# Altium schematic sheet Sheet1.SchDoc
size A3
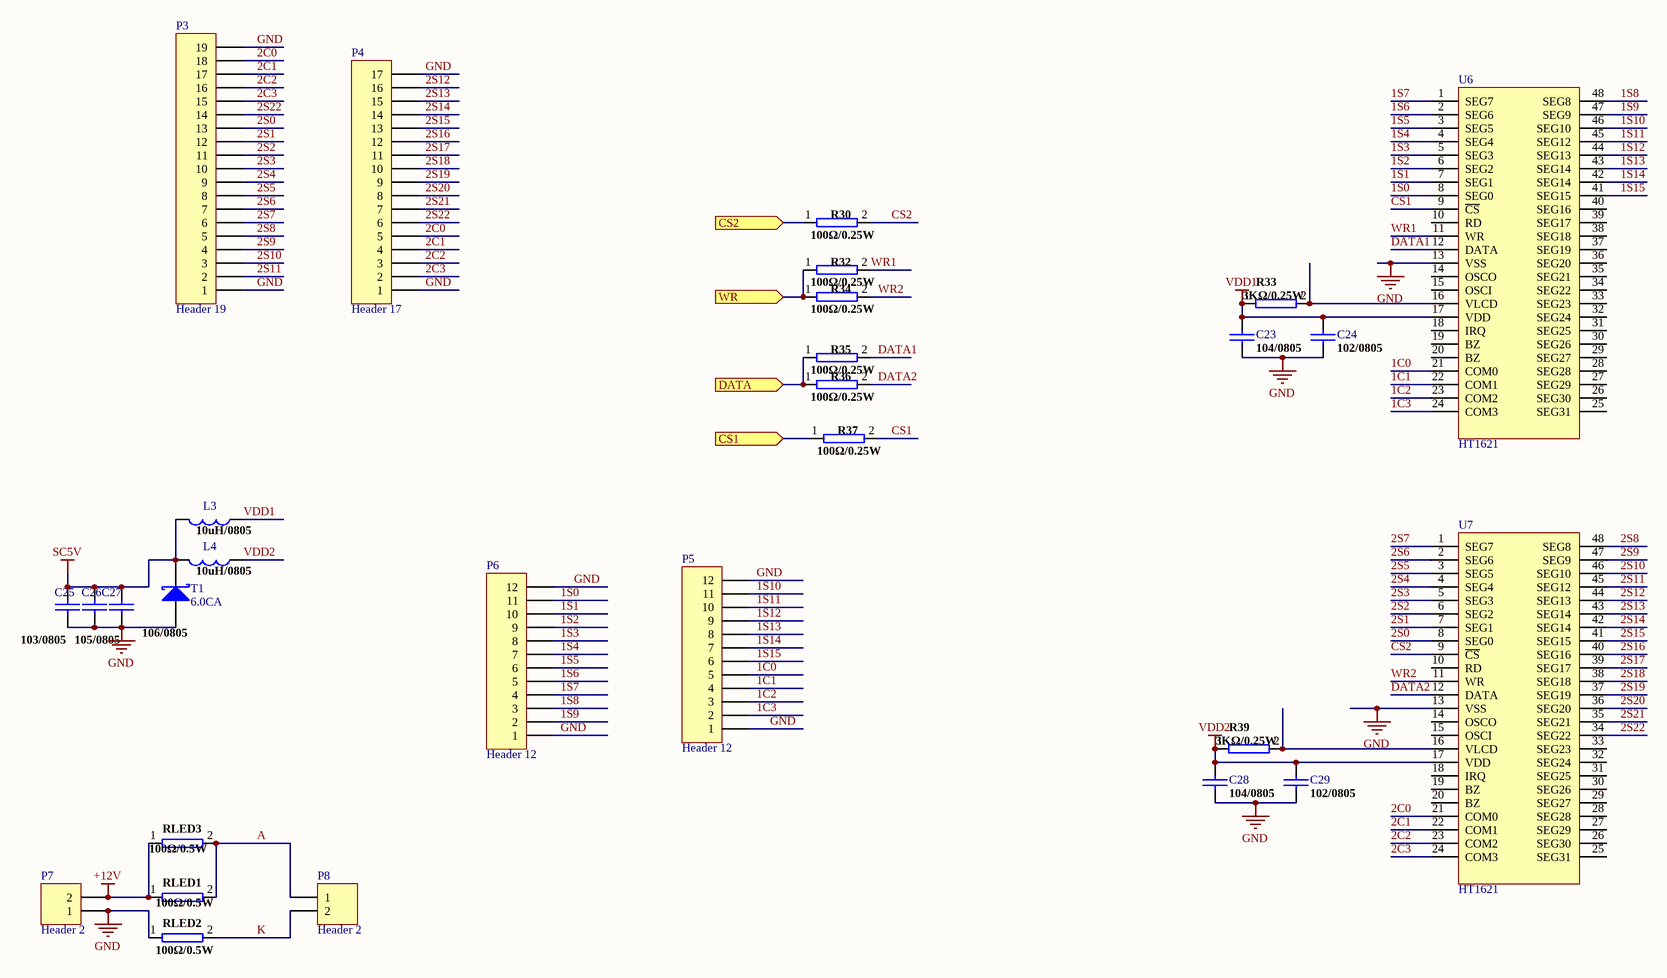
[diagram p0: Sheet1.SchDoc]

## Parts
C23  104/0805  [C0805]
C24  102/0805  [C0805]
C25  103/0805  [C0805]
C26  105/0805  [C0805]
C27  106/0805  [C0805]
C28  104/0805  [C0805]
C29  102/0805  [C0805]
L3  10uH/0805  [L0805]
L4  10uH/0805  [L0805]
P3  Header 19  [H1*19]
P4  Header 17  [H1*17]
P5  Header 12  [H1*12]
P6  Header 12  [H1*12]
P7  Header 2  [CN2]
P8  Header 2  [CN2]
R30  100Ω/0.25W  [R0805]
R32  100Ω/0.25W  [R0805]
R33  3KΩ/0.25W  [R0805]
R34  100Ω/0.25W  [R0805]
R35  100Ω/0.25W  [R0805]
R36  100Ω/0.25W  [R0805]
R37  100Ω/0.25W  [R0805]
R39  3KΩ/0.25W  [R0805]
RLED1  100Ω/0.5W  [1206]
RLED2  100Ω/0.5W  [1206]
RLED3  100Ω/0.5W  [1206]
T1  6.0CA  [TVS]
U6  HT1621  [HT1621B(SSOP)]
U7  HT1621  [HT1621B(SSOP)]

## Ports
CS1 (in), CS2 (in), DATA (in), WR (in)

## Nets
+12V: P7.2 RLED1.1 RLED3.1
GND: C23.2 C24.2 C25.2 C26.2 C27.2 C28.2 C29.2 P3.1 P3.19 P4.1 P4.17 P5.1 P5.12 P6.1 P6.12 P7.1 RLED2.1 T1.1(A) U6.13(VSS) U7.13(VSS)
SC5V: C25.1 C26.1 C27.1 L3.1 L4.1 T1.2(K)
VDD1: C23.1 C24.1 L3.2 R33.1 U6.17(VDD)
VDD2: C28.1 C29.1 L4.2 R39.1 U7.17(VDD)
1C0: P5.5 U6.21(COM0)
1C1: P5.4 U6.22(COM1)
1C2: P5.3 U6.23(COM2)
1C3: P5.2 U6.24(COM3)
1S0: P6.11 U6.8(SEG0)
1S1: P6.10 U6.7(SEG1)
1S2: P6.9 U6.6(SEG2)
1S3: P6.8 U6.5(SEG3)
1S4: P6.7 U6.4(SEG4)
1S5: P6.6 U6.3(SEG5)
1S6: P6.5 U6.2(SEG6)
1S7: P6.4 U6.1(SEG7)
1S8: P6.3 U6.48(SEG8)
1S9: P6.2 U6.47(SEG9)
1S10: P5.11 U6.46(SEG10)
1S11: P5.10 U6.45(SEG12)
1S12: P5.9 U6.44(SEG13)
1S13: P5.8 U6.43(SEG14)
1S14: P5.7 U6.42(SEG14)
1S15: P5.6 U6.41(SEG15)
2C0: P3.18 P4.5 U7.21(COM0)
2C1: P3.17 P4.4 U7.22(COM1)
2C2: P3.16 P4.3 U7.23(COM2)
2C3: P3.15 P4.2 U7.24(COM3)
2S0: P3.13 U7.8(SEG0)
2S1: P3.12 U7.7(SEG1)
2S2: P3.11 U7.6(SEG2)
2S3: P3.10 U7.5(SEG3)
2S4: P3.9 U7.4(SEG4)
2S5: P3.8 U7.3(SEG5)
2S6: P3.7 U7.2(SEG6)
2S7: P3.6 U7.1(SEG7)
2S8: P3.5 U7.48(SEG8)
2S9: P3.4 U7.47(SEG9)
2S10: P3.3 U7.46(SEG10)
2S11: P3.2 U7.45(SEG12)
2S12: P4.16 U7.44(SEG13)
2S13: P4.15 U7.43(SEG14)
2S14: P4.14 U7.42(SEG14)
2S15: P4.13 U7.41(SEG15)
2S16: P4.12 U7.40(SEG16)
2S17: P4.11 U7.39(SEG17)
2S18: P4.10 U7.38(SEG18)
2S19: P4.9 U7.37(SEG19)
2S20: P4.8 U7.36(SEG20)
2S21: P4.7 U7.35(SEG21)
2S22: P3.14 P4.6 U7.34(SEG22)
A: P8.1 RLED1.2 RLED3.2
CS1: R37.2 U6.9(~{CS})
CS1: R37.1 ; port CS1  [a separate net that carries the same name]
CS2: R30.2 U7.9(~{CS})
CS2: R30.1 ; port CS2  [a separate net that carries the same name]
DATA: R35.1 R36.1 ; port DATA
DATA1: R35.2 U6.12(DATA)
DATA2: R36.2 U7.12(DATA)
K: P8.2 RLED2.2
WR: R32.1 R34.1 ; port WR
WR1: R32.2 U6.11(WR)
WR2: R34.2 U7.11(WR)
NetR33_2: R33.2 U6.16(VLCD)
NetR39_2: R39.2 U7.16(VLCD)

Not connected (* = marked no-connect by the designer): U6 10(RD) 14(OSCO) 15(OSCI) 18(IRQ) 19(BZ) 20(BZ) 25(SEG31) 26(SEG30) 27(SEG29) 28(SEG28) 29(SEG27) 30(SEG26) 31(SEG25) 32(SEG24) 33(SEG23) 34(SEG22) 35(SEG21) 36(SEG20) 37(SEG19) 38(SEG18) 39(SEG17) 40(SEG16); U7 10(RD) 14(OSCO) 15(OSCI) 18(IRQ) 19(BZ) 20(BZ) 25(SEG31) 26(SEG30) 27(SEG29) 28(SEG28) 29(SEG27) 30(SEG26) 31(SEG25) 32(SEG24) 33(SEG23)

## Library data of the parts
C23-C29 = CAP: Capacitor
L3 L4 = INDUCTOR1
P3 = Header 19: Header, 19-Pin; LatestRevisionDate: 17-Jul-2002; LatestRevisionNote: Re-released for DXP Platform.; Publisher: Altium Limited
P4 = Header 17: Header, 17-Pin; LatestRevisionDate: 17-Jul-2002; LatestRevisionNote: Re-released for DXP Platform.; Publisher: Altium Limited
P5 P6 = Header 12: Header, 12-Pin; LatestRevisionDate: 17-Jul-2002; LatestRevisionNote: Re-released for DXP Platform.; Publisher: Altium Limited
P7 P8 = Header 2: Header, 2-Pin; LatestRevisionDate: 17-Jul-2002; LatestRevisionNote: Re-released for DXP Platform.; Publisher: Altium Limited
R30 R32-R37 R39 RLED1-RLED3 = RES2
T1 = Diode 11DQ03: Schottky Rectifier; Published: 8-Jun-2000; LatestRevisionDate: 17-Jul-2002; LatestRevisionNote: Re-released for DXP Platform.; DatasheetVersion: Dec-1997; PackageReference: DO-204AL; Publisher: Altium Limited; PackageDescription: Diode, Axial; Body 5.2 x 2.7 mm (LxDia. max), Lead Dia. 0.86 mm (max); Code_JEDEC: DO-204-AL; ComponentLink1Description: Manufacturer Link; ComponentLink1URL: http://www.irf.com/; ComponentLink2Description: Datasheet; ComponentLink2URL: http://www.irf.com/product-info/datasheets/data/11dq03.pdf